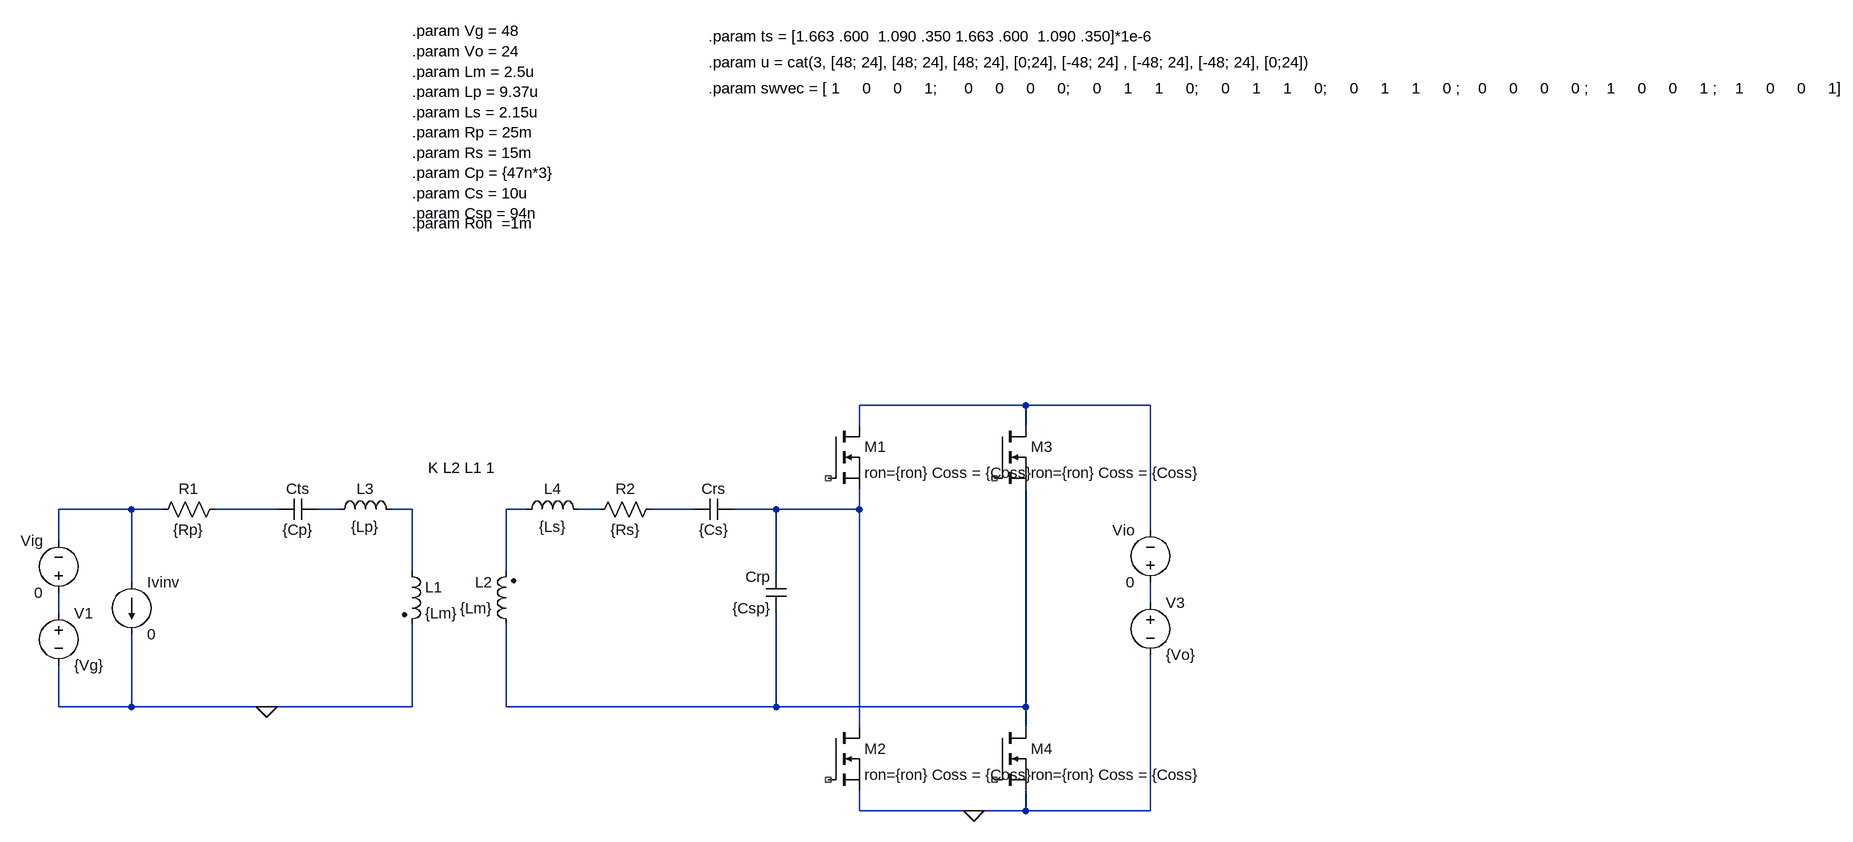
[diagram p0: schematic WPT_VaryingU.asc]
WPT_VaryingU.asc, the LTspice schematic file:
Version 4
SHEET 1 2984 680
WIRE 1584 -160 1328 -160
WIRE 1776 -160 1584 -160
WIRE 1328 -128 1328 -160
WIRE 1584 -128 1584 -160
WIRE 208 0 96 0
WIRE 256 0 208 0
WIRE 432 0 336 0
WIRE 528 0 496 0
WIRE 640 0 608 0
WIRE 816 0 784 0
WIRE 928 0 896 0
WIRE 1072 0 1008 0
WIRE 1200 0 1136 0
WIRE 1328 0 1328 -32
WIRE 1328 0 1200 0
WIRE 1776 32 1776 -160
WIRE 96 48 96 0
WIRE 640 96 640 0
WIRE 784 96 784 0
WIRE 1200 96 1200 0
WIRE 208 112 208 0
WIRE 1776 144 1776 112
WIRE 96 160 96 128
WIRE 96 304 96 240
WIRE 208 304 208 192
WIRE 208 304 96 304
WIRE 416 304 208 304
WIRE 640 304 640 176
WIRE 640 304 416 304
WIRE 784 304 784 176
WIRE 1200 304 1200 160
WIRE 1200 304 784 304
WIRE 1584 304 1584 -32
WIRE 1584 304 1200 304
WIRE 1328 336 1328 0
WIRE 1584 336 1584 304
WIRE 1328 464 1328 432
WIRE 1504 464 1328 464
WIRE 1584 464 1584 432
WIRE 1584 464 1504 464
WIRE 1776 464 1776 224
WIRE 1776 464 1584 464
FLAG 416 304 0
FLAG 1504 464 0
SYMBOL voltage 96 144 R0
SYMATTR InstName V1
SYMATTR Value {Vg}
SYMBOL voltage 96 144 R180
WINDOW 0 24 96 Left 2
WINDOW 3 24 16 Left 2
SYMATTR InstName Vig
SYMATTR Value 0
SYMBOL current 208 112 R0
SYMATTR InstName Ivinv
SYMATTR Value 0
SYMBOL res 352 -16 R90
WINDOW 0 0 56 VBottom 2
WINDOW 3 32 56 VTop 2
SYMATTR InstName R1
SYMATTR Value {Rp}
SYMBOL cap 496 -16 R90
WINDOW 0 0 32 VBottom 2
WINDOW 3 32 32 VTop 2
SYMATTR InstName Cts
SYMATTR Value {Cp}
SYMBOL ind2 624 80 R0
SYMATTR InstName L1
SYMATTR Value {Lm}
SYMATTR Type ind
SYMBOL ind2 800 192 R180
WINDOW 0 36 80 Left 2
WINDOW 3 36 40 Left 2
SYMATTR InstName L2
SYMATTR Value {Lm}
SYMATTR Type ind
SYMBOL res 1024 -16 R90
WINDOW 0 0 56 VBottom 2
WINDOW 3 32 56 VTop 2
SYMATTR InstName R2
SYMATTR Value {Rs}
SYMBOL cap 1136 -16 R90
WINDOW 0 0 32 VBottom 2
WINDOW 3 32 32 VTop 2
SYMATTR InstName Crs
SYMATTR Value {Cs}
SYMBOL cap 1216 160 R180
WINDOW 0 24 56 Left 2
WINDOW 3 24 8 Left 2
SYMATTR InstName Crp
SYMATTR Value {Csp}
SYMBOL ind 512 16 R270
WINDOW 0 32 56 VTop 2
WINDOW 3 5 56 VBottom 2
SYMATTR InstName L3
SYMATTR Value {Lp}
SYMBOL ind 800 16 R270
WINDOW 0 32 56 VTop 2
WINDOW 3 5 56 VBottom 2
SYMATTR InstName L4
SYMATTR Value {Ls}
SYMBOL nmos 1280 -128 R0
SYMATTR InstName M1
SYMATTR Value ron={ron} Coss = {Coss}
SYMBOL nmos 1280 336 R0
SYMATTR InstName M2
SYMATTR Value ron={ron} Coss = {Coss}
SYMBOL nmos 1536 -128 R0
SYMATTR InstName M3
SYMATTR Value ron={ron} Coss = {Coss}
SYMBOL nmos 1536 336 R0
SYMATTR InstName M4
SYMATTR Value ron={ron} Coss = {Coss}
SYMBOL voltage 1776 128 R0
SYMATTR InstName V3
SYMATTR Value {Vo}
SYMBOL voltage 1776 128 R180
WINDOW 0 24 96 Left 2
WINDOW 3 24 16 Left 2
SYMATTR InstName Vio
SYMATTR Value 0
TEXT 664 -64 Left 2 !K L2 L1 1
TEXT 640 -440 Left 2 !.param Ron  =1m
TEXT 640 -736 Left 2 !.param Vg = 48\n.param Vo = 24\n.param Lm = 2.5u\n.param Lp = 9.37u\n.param Ls = 2.15u\n.param Rp = 25m\n.param Rs = 15m\n.param Cp = {47n*3}\n.param Cs = 10u\n.param Csp = 94n
TEXT 1096 -728 Left 2 !.param ts = [1.663 .600  1.090 .350 1.663 .600  1.090 .350]*1e-6
TEXT 1096 -688 Left 2 !.param u = cat(3, [48; 24], [48; 24], [48; 24], [0;24], [-48; 24] , [-48; 24], [-48; 24], [0;24])
TEXT 1096 -648 Left 2 !.param swvec = [ 1     0     0     1;      0     0     0     0;     0     1     1     0;     0     1     1     0;     0     1     1     0 ;    0     0     0     0 ;    1     0     0     1 ;    1     0     0     1]

The netlist it stands for:
* WPT_VaryingU.asc
V1 N011 0 {Vg}
Vig N011 N002 0
Ivinv N002 0 0
R1 N003 N002 {Rp}
Cts N004 N003 {Cp}
L1 N005 0 {Lm}
L2 N012 N006 {Lm}
R2 N008 N007 {Rs}
Crs N009 N008 {Cs}
Crp N012 N009 {Csp}
L3 N004 N005 {Lp}
L4 N006 N007 {Ls}
M1 N001 NC_01 N009 N009 ron={ron} Coss = {Coss}
M2 N009 NC_02 0 0 ron={ron} Coss = {Coss}
M3 N001 NC_03 N012 N012 ron={ron} Coss = {Coss}
M4 N012 NC_04 0 0 ron={ron} Coss = {Coss}
V3 N010 0 {Vo}
Vio N010 N001 0
.model NMOS NMOS
.model PMOS PMOS
.lib standard.mos
K L2 L1 1
.param Ron  =1m
.param Vg = 48
.param Vo = 24
.param Lm = 2.5u
.param Lp = 9.37u
.param Ls = 2.15u
.param Rp = 25m
.param Rs = 15m
.param Cp = {47n*3}
.param Cs = 10u
.param Csp = 94n
.param ts = [1.663 .600  1.090 .350 1.663 .600  1.090 .350]*1e-6
.param u = cat(3, [48; 24], [48; 24], [48; 24], [0;24], [-48; 24] , [-48; 24], [-48; 24], [0;24])
.param swvec = [ 1     0     0     1;      0     0     0     0;     0     1     1     0;     0     1     1     0;     0     1     1     0 ;    0     0     0     0 ;    1     0     0     1 ;    1     0     0     1]
.backanno
.end